# Altium schematic sheet ir.SchDoc
size A4; SheetNumber: 2; SheetTotal: 2
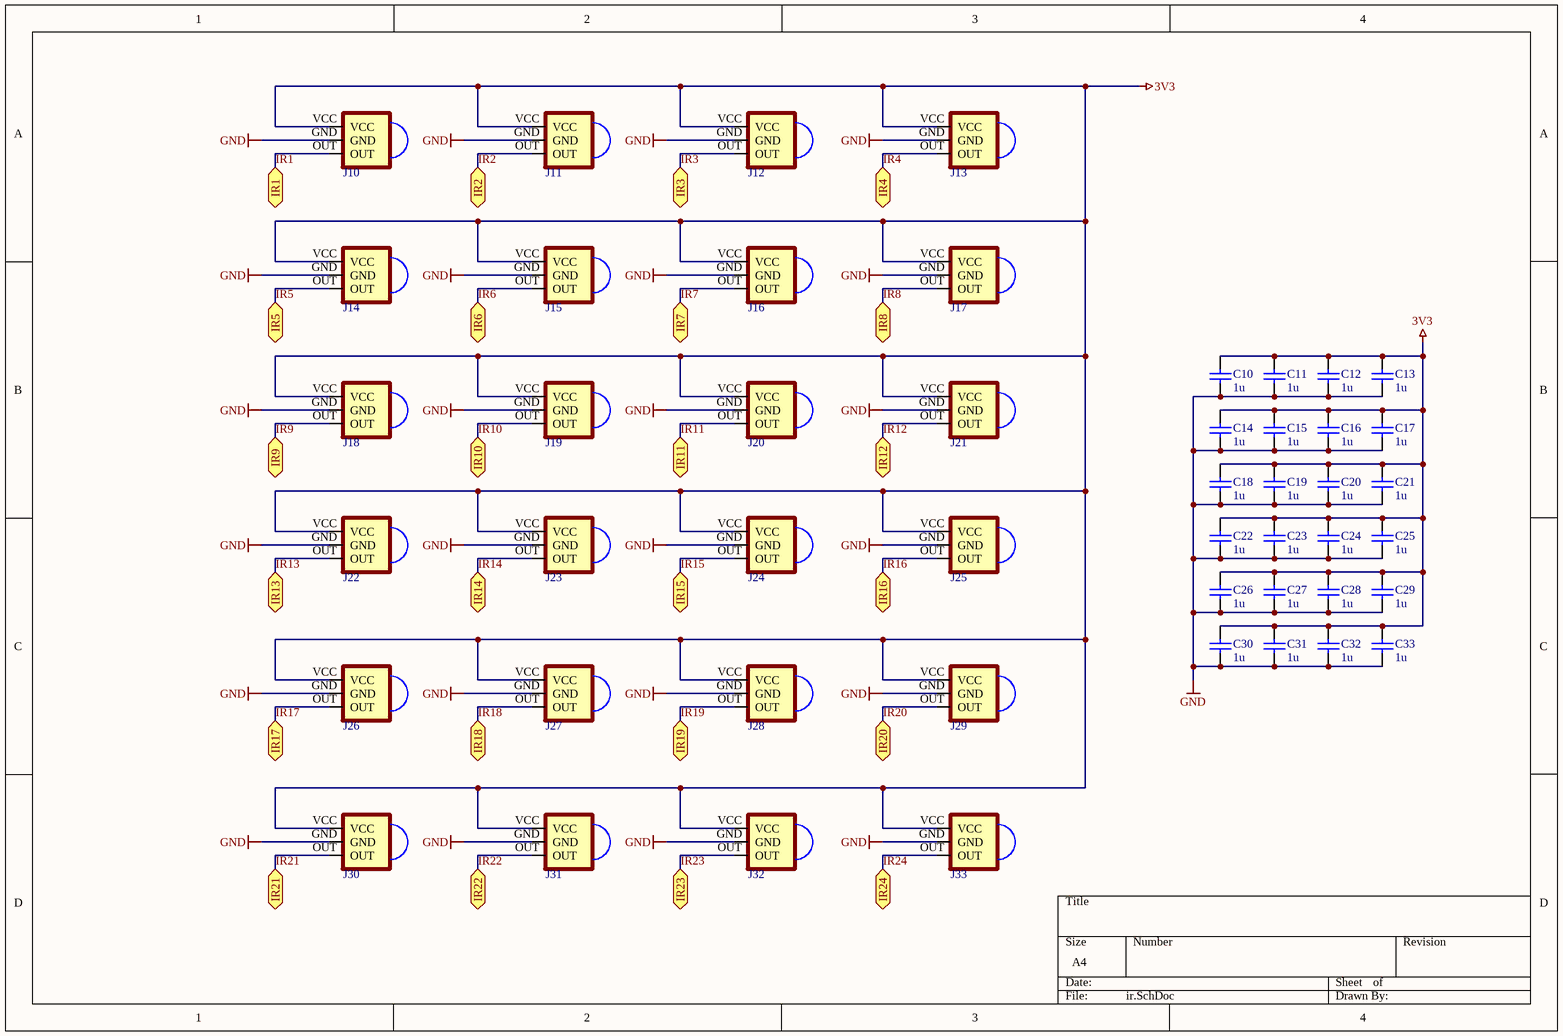
[diagram p0: ir.SchDoc]

## Parts
C10  1u  [CAP0603]
C11  1u  [CAP0603]
C12  1u  [CAP0603]
C13  1u  [CAP0603]
C14  1u  [CAP0603]
C15  1u  [CAP0603]
C16  1u  [CAP0603]
C17  1u  [CAP0603]
C18  1u  [CAP0603]
C19  1u  [CAP0603]
C20  1u  [CAP0603]
C21  1u  [CAP0603]
C22  1u  [CAP0603]
C23  1u  [CAP0603]
C24  1u  [CAP0603]
C25  1u  [CAP0603]
C26  1u  [CAP0603]
C27  1u  [CAP0603]
C28  1u  [CAP0603]
C29  1u  [CAP0603]
C30  1u  [CAP0603]
C31  1u  [CAP0603]
C32  1u  [CAP0603]
C33  1u  [CAP0603]
J10  TSSP58038  [TSSP58038]  (value not drawn)
J11  TSSP58038  [TSSP58038]  (value not drawn)
J12  TSSP58038  [TSSP58038]  (value not drawn)
J13  TSSP58038  [TSSP58038]  (value not drawn)
J14  TSSP58038  [TSSP58038]  (value not drawn)
J15  TSSP58038  [TSSP58038]  (value not drawn)
J16  TSSP58038  [TSSP58038]  (value not drawn)
J17  TSSP58038  [TSSP58038]  (value not drawn)
J18  TSSP58038  [TSSP58038]  (value not drawn)
J19  TSSP58038  [TSSP58038]  (value not drawn)
J20  TSSP58038  [TSSP58038]  (value not drawn)
J21  TSSP58038  [TSSP58038]  (value not drawn)
J22  TSSP58038  [TSSP58038]  (value not drawn)
J23  TSSP58038  [TSSP58038]  (value not drawn)
J24  TSSP58038  [TSSP58038]  (value not drawn)
J25  TSSP58038  [TSSP58038]  (value not drawn)
J26  TSSP58038  [TSSP58038]  (value not drawn)
J27  TSSP58038  [TSSP58038]  (value not drawn)
J28  TSSP58038  [TSSP58038]  (value not drawn)
J29  TSSP58038  [TSSP58038]  (value not drawn)
J30  TSSP58038  [TSSP58038]  (value not drawn)
J31  TSSP58038  [TSSP58038]  (value not drawn)
J32  TSSP58038  [TSSP58038]  (value not drawn)
J33  TSSP58038  [TSSP58038]  (value not drawn)

## Ports
IR1 (bidir), IR2 (bidir), IR3 (bidir), IR4 (bidir), IR5 (bidir), IR6 (bidir), IR7 (bidir), IR8 (bidir), IR9 (bidir), IR10 (bidir), IR11 (bidir), IR12 (bidir), IR13 (bidir), IR14 (bidir), IR15 (bidir), IR16 (bidir), IR17 (bidir), IR18 (bidir), IR19 (bidir), IR20 (bidir), IR21 (bidir), IR22 (bidir), IR23 (bidir), IR24 (bidir)

## Nets
3V3: C10.2 C11.2 C12.2 C13.2 C14.2 C15.2 C16.2 C17.2 C18.2 C19.2 C20.2 C21.2 C22.2 C23.2 C24.2 C25.2 C26.2 C27.2 C28.2 C29.2 C30.2 C31.2 C32.2 C33.2 J10.VCC J11.VCC J12.VCC J13.VCC J14.VCC J15.VCC J16.VCC J17.VCC J18.VCC J19.VCC J20.VCC J21.VCC J22.VCC J23.VCC J24.VCC J25.VCC J26.VCC J27.VCC J28.VCC J29.VCC J30.VCC J31.VCC J32.VCC J33.VCC
GND: C10.1 C11.1 C12.1 C13.1 C14.1 C15.1 C16.1 C17.1 C18.1 C19.1 C20.1 C21.1 C22.1 C23.1 C24.1 C25.1 C26.1 C27.1 C28.1 C29.1 C30.1 C31.1 C32.1 C33.1 J10.GND J11.GND J12.GND J13.GND J14.GND J15.GND J16.GND J17.GND J18.GND J19.GND J20.GND J21.GND J22.GND J23.GND J24.GND J25.GND J26.GND J27.GND J28.GND J29.GND J30.GND J31.GND J32.GND J33.GND
IR1: J10.OUT ; port IR1
IR2: J11.OUT ; port IR2
IR3: J12.OUT ; port IR3
IR4: J13.OUT ; port IR4
IR5: J14.OUT ; port IR5
IR6: J15.OUT ; port IR6
IR7: J16.OUT ; port IR7
IR8: J17.OUT ; port IR8
IR9: J18.OUT ; port IR9
IR10: J19.OUT ; port IR10
IR11: J20.OUT ; port IR11
IR12: J21.OUT ; port IR12
IR13: J22.OUT ; port IR13
IR14: J23.OUT ; port IR14
IR15: J24.OUT ; port IR15
IR16: J25.OUT ; port IR16
IR17: J26.OUT ; port IR17
IR18: J27.OUT ; port IR18
IR19: J28.OUT ; port IR19
IR20: J29.OUT ; port IR20
IR21: J30.OUT ; port IR21
IR22: J31.OUT ; port IR22
IR23: J32.OUT ; port IR23
IR24: J33.OUT ; port IR24

## Library data of the parts
C10-C33 = CAP0603: 0603 Capacitor
J10-J33 = CMP-073-000000-6: 38 kHz 25 m 45° 5.5 V Through Hole IR Receiver Module for Light Barrier Systems; MF: Vishay; Package: TSSP; Design Item ID: TSSP58038; Value: *; MP: TSSP58038; Component Type: Standard; Pin Count: 3